# Altium schematic sheet 6_FPGA_Miscellaneous.SchDoc
size A4; Organization: SpaceLab UFSC; Address1: UFSC - SpaceLab; Address2: University Campus - Trindade; Address3: Dep. of Electrical Engineering - CTC; Address4: Florianópolis, Santa Catarina, Brazil; Address5: CEP: 88040 - 900
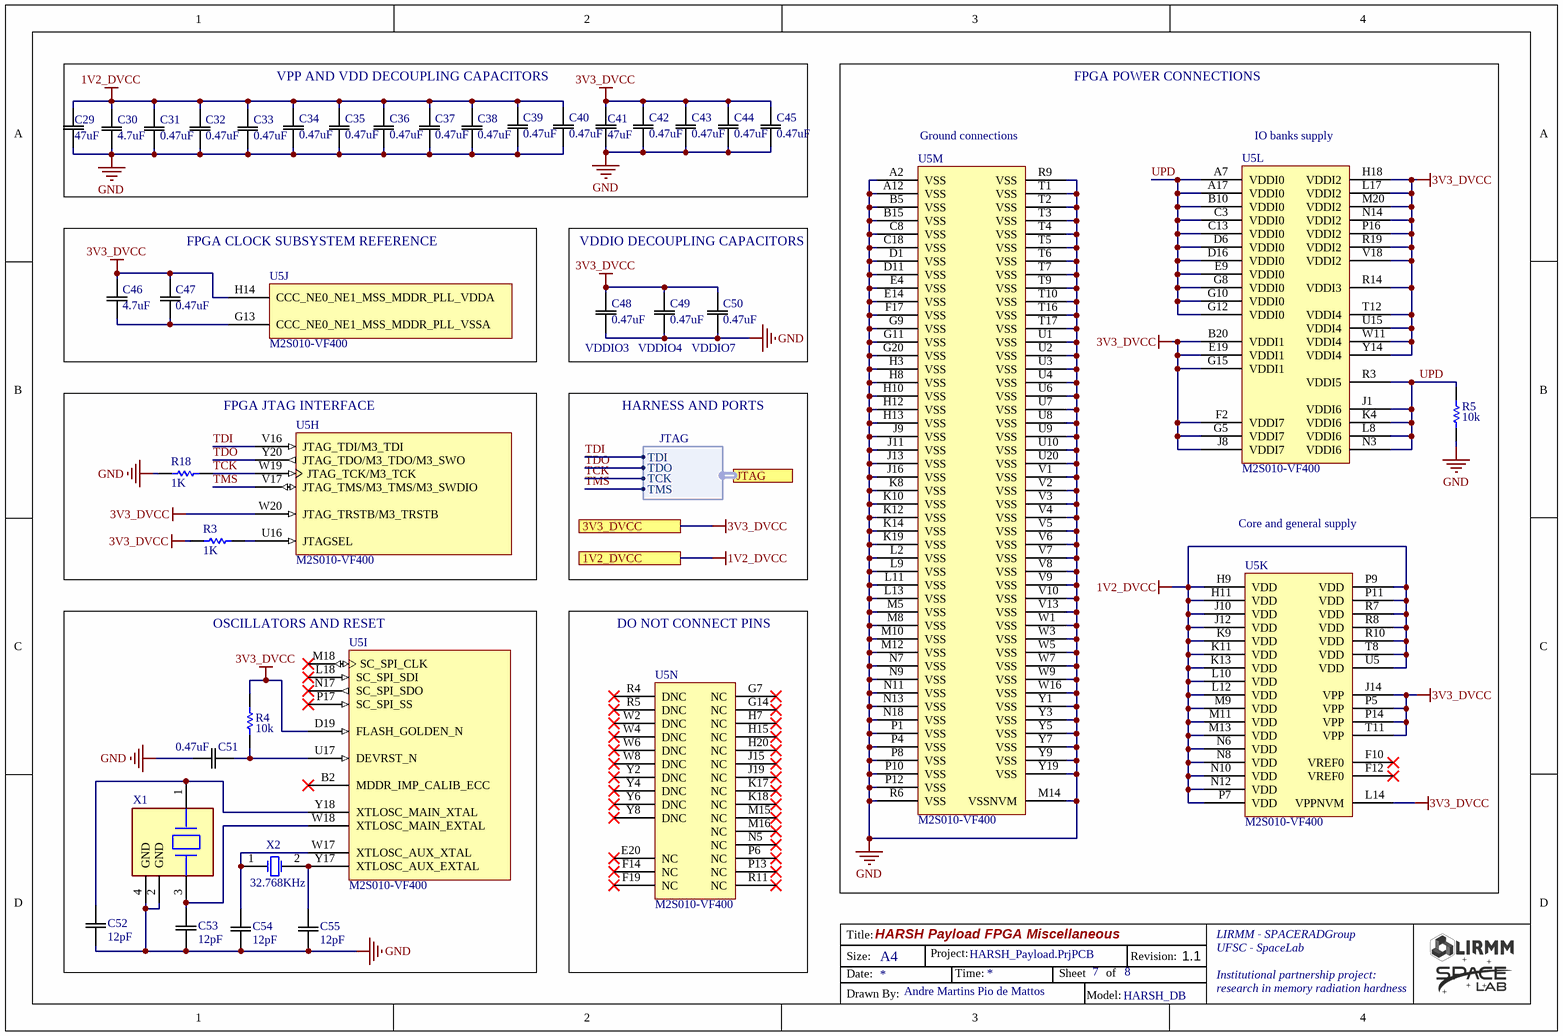
[diagram p0: 6_FPGA_Miscellaneous.SchDoc]

## Parts
C29  value 47uF  [DONE_C0603]  (hidden comment: ZRB18AR60J476ME01L)
C30  4.7uF  [DONE_C0603]
C31  value 0.47uF  [DONE_C0402]  (hidden comment: GRM155R71A474KE01D)
C32  value 0.47uF  [DONE_C0402]  (hidden comment: GRM155R71A474KE01D)
C33  value 0.47uF  [DONE_C0402]  (hidden comment: GRM155R71A474KE01D)
C34  value 0.47uF  [DONE_C0402]  (hidden comment: GRM155R71A474KE01D)
C35  value 0.47uF  [DONE_C0402]  (hidden comment: GRM155R71A474KE01D)
C36  value 0.47uF  [DONE_C0402]  (hidden comment: GRM155R71A474KE01D)
C37  value 0.47uF  [DONE_C0402]  (hidden comment: GRM155R71A474KE01D)
C38  value 0.47uF  [DONE_C0402]  (hidden comment: GRM155R71A474KE01D)
C39  value 0.47uF  [DONE_C0402]  (hidden comment: GRM155R71A474KE01D)
C40  value 0.47uF  [DONE_C0402]  (hidden comment: GRM155R71A474KE01D)
C41  value 47uF  [DONE_C0603]  (hidden comment: ZRB18AR60J476ME01L)
C42  value 0.47uF  [DONE_C0402]  (hidden comment: GRM155R71A474KE01D)
C43  value 0.47uF  [DONE_C0402]  (hidden comment: GRM155R71A474KE01D)
C44  value 0.47uF  [DONE_C0402]  (hidden comment: GRM155R71A474KE01D)
C45  value 0.47uF  [DONE_C0402]  (hidden comment: GRM155R71A474KE01D)
C46  4.7uF  [DONE_C0603]
C47  value 0.47uF  [DONE_C0402]  (hidden comment: GRM155R71A474KE01D)
C48  value 0.47uF  [DONE_C0402]  (hidden comment: GRM155R71A474KE01D)
C49  value 0.47uF  [DONE_C0402]  (hidden comment: GRM155R71A474KE01D)
C50  value 0.47uF  [DONE_C0402]  (hidden comment: GRM155R71A474KE01D)
C51  value 0.47uF  [DONE_C0402]  (hidden comment: GRM155R71A474KE01D)
C52  12pF  [DONE_C0603]
C53  12pF  [DONE_C0603]
C54  12pF  [DONE_C0603]
C55  12pF  [DONE_C0603]
R3  1K  [DONE_R0603]
R4  10k  [DONE_R0603]
R5  10k  [DONE_R0603]
R18  1K  [DONE_R0603]
U5  M2S010-VF400  [DONE_MCSM_VF_400]  (parts H,I,J,K,L,M,N of 14)
X1  ABM8AIG-12.000MHz-12-D2Z-T  [DONE_XTAL_ABM8AIG]  (value not drawn)
X2  32.768KHz  [DONE_XTAL]

## Blocks framed on the sheet
VPP AND VDD DECOUPLING CAPACITORS: C29-C45
FPGA POWER CONNECTIONS: R5 U5
FPGA CLOCK SUBSYSTEM REFERENCE: C46 C47 U5
VDDIO DECOUPLING CAPACITORS: C48-C50
FPGA JTAG INTERFACE: R3 R18 U5
OSCILLATORS AND RESET: C51-C55 R4 U5 X1 X2
DO NOT CONNECT PINS: U5

## Ports
1V2_DVCC, 3V3_DVCC, JTAG (harness JTAG)

## Harnesses
JTAG: TDI, TDO, TCK, TMS

## Nets
1V2_DVCC: C29.1 C30.1 C31.1 C32.1 C33.1 C34.1 C35.1 C36.1 C37.1 C38.1 C39.1 C40.1 U5.H9(VDD) U5.H11(VDD) U5.J10(VDD) U5.J12(VDD) U5.K9(VDD) U5.K11(VDD) U5.K13(VDD) U5.L10(VDD) U5.L12(VDD) U5.M9(VDD) U5.M11(VDD) U5.M13(VDD) U5.N6(VDD) U5.N8(VDD) U5.N10(VDD) U5.N12(VDD) U5.P7(VDD) U5.P9(VDD) U5.P11(VDD) U5.R7(VDD) U5.R8(VDD) U5.R10(VDD) U5.T8(VDD) U5.U5(VDD) ; port 1V2_DVCC
3V3_DVCC: C41.1 C42.1 C43.1 C44.1 C45.1 C46.1 C47.1 C48.1 C49.1 C50.1 R3.2 R4.2 U5.B20(VDDI1) U5.D19(FLASH_GOLDEN_N) U5.E19(VDDI1) U5.F2(VDDI7) U5.G5(VDDI7) U5.G15(VDDI1) U5.H14(CCC_NE0_NE1_MSS_MDDR_PLL_VDDA) U5.H18(VDDI2) U5.J8(VDDI7) U5.J14(VPP) U5.L14(VPPNVM) U5.L17(VDDI2) U5.M20(VDDI2) U5.N14(VDDI2) U5.P5(VPP) U5.P14(VPP) U5.P16(VDDI2) U5.R14(VDDI3) U5.R19(VDDI2) U5.T11(VPP) U5.T12(VDDI4) U5.U15(VDDI4) U5.V18(VDDI2) U5.W11(VDDI4) U5.W20(JTAG_TRSTB/M3_TRSTB) U5.Y14(VDDI4) ; port 3V3_DVCC
GND: C29.2 C30.2 C31.2 C32.2 C33.2 C34.2 C35.2 C36.2 C37.2 C38.2 C39.2 C40.2 C41.2 C42.2 C43.2 C44.2 C45.2 C48.2 C49.2 C50.2 C51.1 C52.2 C53.2 C54.2 C55.2 R5.1 R18.2 U5.A2(VSS) U5.A12(VSS) U5.B5(VSS) U5.B15(VSS) U5.C8(VSS) U5.C18(VSS) U5.D1(VSS) U5.D11(VSS) U5.E4(VSS) U5.E14(VSS) U5.F17(VSS) U5.G9(VSS) U5.G11(VSS) U5.G20(VSS) U5.H3(VSS) U5.H8(VSS) U5.H10(VSS) U5.H12(VSS) U5.H13(VSS) U5.J9(VSS) U5.J11(VSS) U5.J13(VSS) U5.J16(VSS) U5.K8(VSS) U5.K10(VSS) U5.K12(VSS) U5.K14(VSS) U5.K19(VSS) U5.L2(VSS) U5.L9(VSS) U5.L11(VSS) U5.L13(VSS) U5.M5(VSS) U5.M8(VSS) U5.M10(VSS) U5.M12(VSS) U5.M14(VSSNVM) U5.N7(VSS) U5.N9(VSS) U5.N11(VSS) U5.N13(VSS) U5.N18(VSS) U5.P1(VSS) U5.P4(VSS) U5.P8(VSS) U5.P10(VSS) U5.P12(VSS) U5.R6(VSS) U5.R9(VSS) U5.T1(VSS) U5.T2(VSS) U5.T3(VSS) U5.T4(VSS) U5.T5(VSS) U5.T6(VSS) U5.T7(VSS) U5.T9(VSS) U5.T10(VSS) U5.T16(VSS) U5.T17(VSS) U5.U1(VSS) U5.U2(VSS) U5.U3(VSS) U5.U4(VSS) U5.U6(VSS) U5.U7(VSS) U5.U8(VSS) U5.U9(VSS) U5.U10(VSS) U5.U20(VSS) U5.V1(VSS) U5.V2(VSS) U5.V3(VSS) U5.V4(VSS) U5.V5(VSS) U5.V6(VSS) U5.V7(VSS) U5.V8(VSS) U5.V9(VSS) U5.V10(VSS) U5.V13(VSS) U5.W1(VSS) U5.W3(VSS) U5.W5(VSS) U5.W7(VSS) U5.W9(VSS) U5.W16(VSS) U5.Y1(VSS) U5.Y3(VSS) U5.Y5(VSS) U5.Y7(VSS) U5.Y9(VSS) U5.Y19(VSS) X1.2(GND) X1.4(GND)
TCK: R18.1 U5.W19(JTAG_TCK/M3_TCK) ; port JTAG.TCK
TDI: U5.V16(JTAG_TDI/M3_TDI) ; port JTAG.TDI
TDO: U5.Y20(JTAG_TDO/M3_TDO/M3_SWO) ; port JTAG.TDO
TMS: U5.V17(JTAG_TMS/M3_TMS/M3_SWDIO) ; port JTAG.TMS
UPD: R5.2 U5.A7(VDDI0) U5.A17(VDDI0) U5.B10(VDDI0) U5.C3(VDDI0) U5.C13(VDDI0) U5.D6(VDDI0) U5.D16(VDDI0) U5.E9(VDDI0) U5.G8(VDDI0) U5.G10(VDDI0) U5.G12(VDDI0) U5.J1(VDDI6) U5.K4(VDDI6) U5.L8(VDDI6) U5.N3(VDDI6) U5.R3(VDDI5)
NetC46_2: C46.2 C47.2 U5.G13(CCC_NE0_NE1_MSS_MDDR_PLL_VSSA)
NetC51_2: C51.2 R4.1 U5.U17(DEVRST_N)
NetC52_1: C52.1 U5.Y18(XTLOSC_MAIN_XTAL) X1.1(1_Crystal)
NetC53_1: C53.1 U5.W18(XTLOSC_MAIN_EXTAL) X1.3(2_Crystal)
NetC54_1: C54.1 U5.W17(XTLOSC_AUX_XTAL) X2.1(OSC1)
NetC55_1: C55.1 U5.Y17(XTLOSC_AUX_EXTAL) X2.2(OSC2)
NetR3_1: R3.1 U5.U16(JTAGSEL)

Not connected (* = marked no-connect by the designer): U5 B2(MDDR_IMP_CALIB_ECC)* E20(NC)* F10(VREF0)* F12(VREF0)* F14(NC)* F19(NC)* G7(NC)* G14(NC)* H7(NC)* H15(NC)* H20(NC)* J15(NC)* J19(NC)* K17(NC)* K18(NC)* L18(SC_SPI_SDI)* M15(NC)* M16(NC)* M18(SC_SPI_CLK)* N5(NC)* N17(SC_SPI_SDO)* P6(NC)* P13(NC)* P17(SC_SPI_SS)* R4(DNC)* R5(DNC)* R11(NC)* W2(DNC)* W4(DNC)* W6(DNC)* W8(DNC)* Y2(DNC)* Y4(DNC)* Y6(DNC)* Y8(DNC)*

## Notes on the sheet
- (near U5) Ground connections
- (near U5) IO banks supply
- (near C48) VDDIO3
- (near C49) VDDIO4
- VDDIO7
- HARNESS AND PORTS
- Core and general supply
- HARSH Payload FPGA Miscellaneous
- HARSH_Payload.PrjPCB
- 7
- 8
- 1.1
- Andre Martins Pio de Mattos
- HARSH_DB
- Title:
- Size:
- Date:
- A4
- Project:
- Time:
- Sheet
- of
- Revision:
- LIRMM - SPACERADGroup
- UFSC - SpaceLab
- Institutional partnership project:
- research in memory radiation hardness
- Drawn By:
- Model:

## Library data of the parts
C29 C41 = DONE_CAP_47uF_0603_X5R: CAP CER 47UF 6.3V 20% X5R 0603; Voltage: 10V; Partnumber: ZRB18AR60J476ME01L
C30 C46 = DONE_CAP_4.7uF_0603_X5R: CAP CER 4.7UF 10V 10% X5R 0603; Partnumber: C0603C475K8PACTU; Category: Ceramic; Dielectric: X5R; Voltage: 10V; Value: 4.7uF
C31-C40 C42-C45 C47-C51 = DONE_CAP_0.47uF_0402_X7R: CAP CER 0.47UF 10V X7R 0402; Manufacturer: Murata; Mount Type: SMD; Category: Ceramic; Dielectric: X7R; Supplier 1: Allied; Supplier 2: Mouser; Supplier 3: Newark; Supplier 4: Digi-Key; Supplier 5: Farnell; Supplier Part Number 1: 70096227; PartNumber: GRM155R71A474KE01D; Voltage: 10V
C52-C55 = DONE_CAP_12pF_0603: CAP CER 12PF 50V C0G/NPO 0603; Partnumber: CC0603JRNPO9BN120; Case Code (Imperial): 0603; Voltage Rating: 50V; Voltage Rating (DC): 50v; Capacitance: 12pF
R3 R18 = DONE_RES_1K_0603: RES SMD 1K OHM 1% 1/4W 0603; Manufacturer: Rohm; Manufacturer Part Number: ESR03EZPF1001; Power Rating: 250mW; Temperature Coefficient: 100ppm/°C; ComponentLink1Description: digikey; ComponentLink1URL: https://www.digikey.com/product-detail/en/rohm-semiconductor/ESR03EZPF1001/RHM1.00KADCT-ND/1983752; Supplier 1: Digi-Key; Stock 1: 24170; Pricing 1: 1=0.14, 10=0.126, 100=0.0484, 1000=0.0213, 2500=0.0184 (USD); Case/Package: 0603; Case Code (Metric): 1608; Case Code (Imperial): 0603; Min Operating Temperature: -55°C; Max Operating Temperature: 155°C; Package Quantity: 1; Tolerance: 1%; Packaging: Tape and Reel; Composition: Thick Film; Number of Terminations: 2; Max Power Dissipation: 250mW; Length: 0.063inch; Height: 0.022inch; Width: 0.031inch; Lead Free: Lead Free; ComponentLink2URL: https://datasheet.ciiva.com/2469/esr-2469712.pdf; ComponentLink2Description: https://datasheet.ciiva.com/2469/esr-2469712.pdf; ComponentLink3URL: https://datasheet.ciiva.com/2469/esr-2469713.pdf; ComponentLink3Description: https://datasheet.ciiva.com/2469/esr-2469713.pdf; ComponentLink4URL: https://datasheet.ciiva.com/2469/esr-2469714.pdf; ComponentLink4Description: https://datasheet.ciiva.com/2469/esr-2469714.pdf; Supplier Part Number 1: RHM1.00KADCT-ND; Resistance: 1K; Partnumber: ESR03EZPF1001
R4 R5 = DONE_RES_10K_0603: 1/8W 1%  0603 10K; Partnumber: MCT0603MC1002FP500; Manufacturer: Vishay Beyschlag; Resistance: 10kR; Power Rating: 125mW; Voltage Rating: 75V; NCM: 8533.21.20; Supplier 1: Digi-Key; Manufacturer Part Number: MCT0603MC1002FP500; Stock 1: 29986; Pricing 1: 1=0.37, 10=0.313, 100=0.1222, 1000=0.0511, 2500=0.0469 (USD); Case/Package: 0603; Weight: 7.1E-05oz; Case Code (Imperial): 0603; Case Code (Metric): 1608; Min Operating Temperature: -55°C; Max Operating Temperature: 155°C; Packaging: Tape and Reel; Tolerance: 1%; Package Quantity: 5000; Termination: SMD/SMT; Composition: Thin Film; Length: 1.6mm; Height: 0.45mm; Width: 0.8mm; ComponentLink1URL: http://www.mouser.com/ds/2/427/mcat_pro-223602.pdf; ComponentLink1Description: http://www.mouser.com/ds/2/427/mcat_pro-223602.pdf; ComponentLink2URL: http://www.vishay.com/docs/28760/mcat_pro.pdf; ComponentLink2Description: http://www.vishay.com/docs/28760/mcat_pro.pdf; Supplier Part Number 1: MCT0603-10.0K-MFCT-ND
U5 = DONE_M2S010-VF400: SmartFusion2 SoC FPGA, ARM Cortex-M3, 10 K LUTs, 195 User I/O, Design Security, 0 to 85 degC, 400-Ball BGA; Manufacturer: Microsemi; DDR Controllers (Count x Width): 1x18; MSIO (3.3V): 99; PLLs and CCCs: 2; eSRAM (K Bytes) Non SECDED: 80; SERDES Lanes: 4; Total User I/O: 195; eSRAM (K Bytes): 64; uSRAM1K Blocks: 22; Maximum Logic Elements: 12,084; MSIOD (2.5V): 32; eNVM (K Bytes): 256; Total RAM (K bits): 400; LSRAM 18K Blocks: 21; PartNumber: M2S010-VF400; PackageVersion: Rev. 48, 11/2013; ComponentLink1Description: Manufacturer URL; ComponentLink2Description: Datasheet; DatasheetVersion: Rev. 5; ComponentLink3URL: http://www.microsemi.com/document-portal/doc_download/131095-package-mechanical-drawings; ComponentLink1URL: http://www.microsemi.com/; ComponentLink2URL: http://www.microsemi.com/document-portal/doc_download/130717-smartfusion2-datasheet; PackageReference: VF-400; ComponentLink3Description: Package Specification; Math Blocks (18x18): 22; RoHS: FALSE; DDRIO (2.5V): 64; Mounting Technology: Surface Mount; PackageDescription: 400-Ball Very Fine Pitch Ball Grid Array, Body 17 x 17 mm, Pitch 0.8 mm
X1 = DONE_XTAL_12MHz: Crystals 12MHz 12pF 20ppm ESR 100 -40C +85C; Partnumber: ABM8AIG-12.000MHz-12-D2Z-T
X2 = DONE_XTAL_32.768KHz: Partnumber: LFXTAL009678REEL; Published: 8-Jun-2000; LatestRevisionDate: 17-Jul-2002; LatestRevisionNote: Re-released for DXP Platform.; PackageReference: R38; Publisher: Altium Limited; PackageDescription: Crystal, Thru-Hole; 2 Leads; Body 3.1 x 8.2 mm (Dia.xH)